# EAGLE design led_driver_1 (EAGLE 7.7.0)
DRAWING_NUMBER: V001; DRAWN: Mario Blunk / Blunk electronic; PROJECT: agile HW demo; STATUS: development

## Sheet 1 of 3: led driver
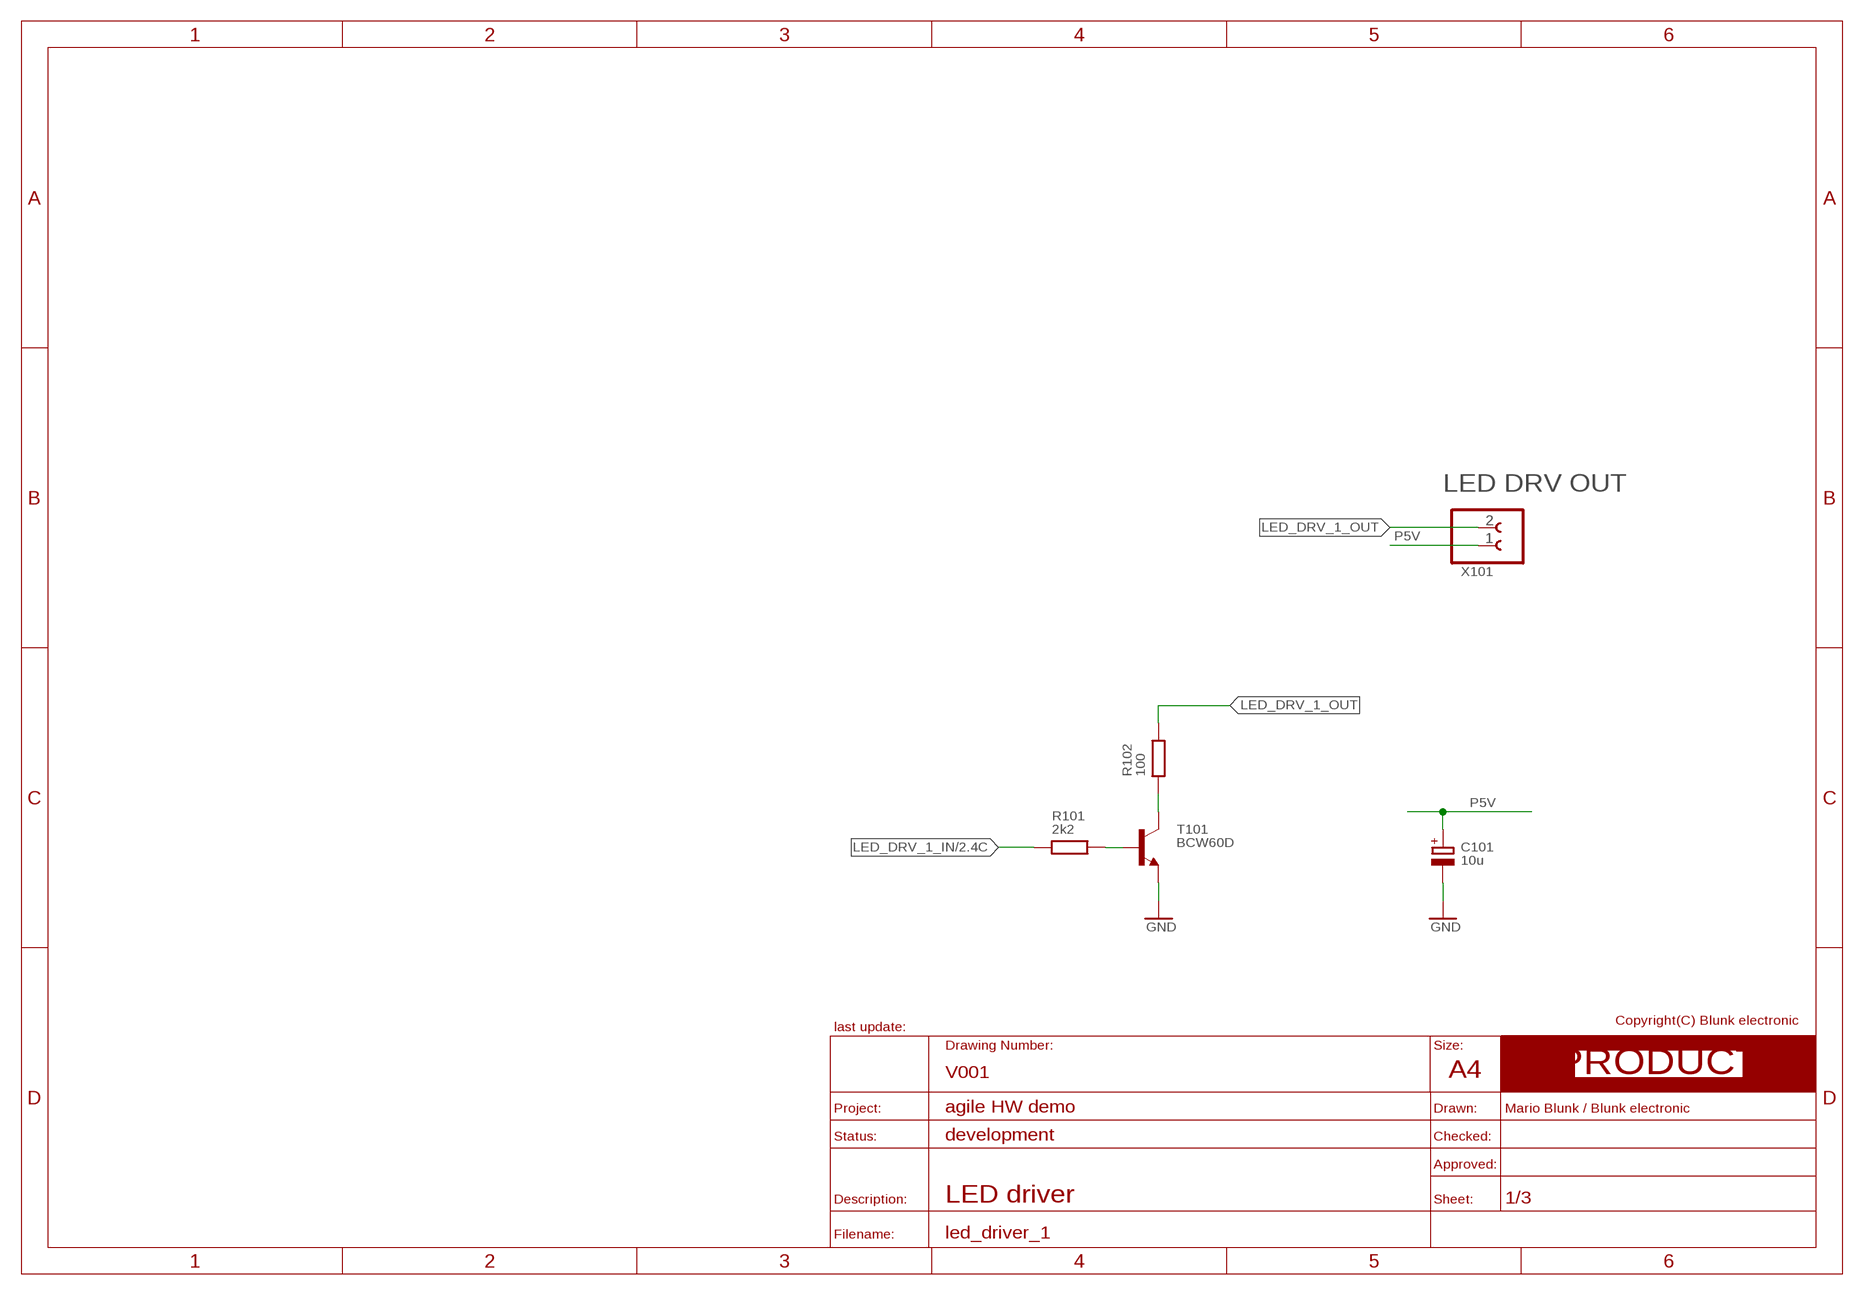
[diagram p0: schematic, sheet 1]
FRAME_PRODUCT1 (A4_LANDSCAPE_PRODUCT): BOM: NO; COMMISSIONED: 2013-08-30; DESCRIPTION: LED driver

### Parts
C101  10u  C_POL_S_6032  [S_6032]
R101  2k2  R_S_0805  [S_0805]
R102  100  R_S_0805  [S_0805]
T101  BCW60D  NPN_S_SOT23  [S_SOT23]
X101  CLAMP_1X2-T-2.5MM  [T_WIRE_CLAMP_1X2_PITCH_2MM5]

### Nets
GND: C101.- T101.2(E) ; also sheet 2,3
LED_DRV_1_B: R101.2 T101.1(B)
LED_DRV_1_C: R102.1 T101.3(C)
LED_DRV_1_IN: R101.1 ; also sheet 2
LED_DRV_1_OUT: R102.2 X101.2
P5V: C101.+ X101.1 ; also sheet 3

## Sheet 2 of 3: led module backend
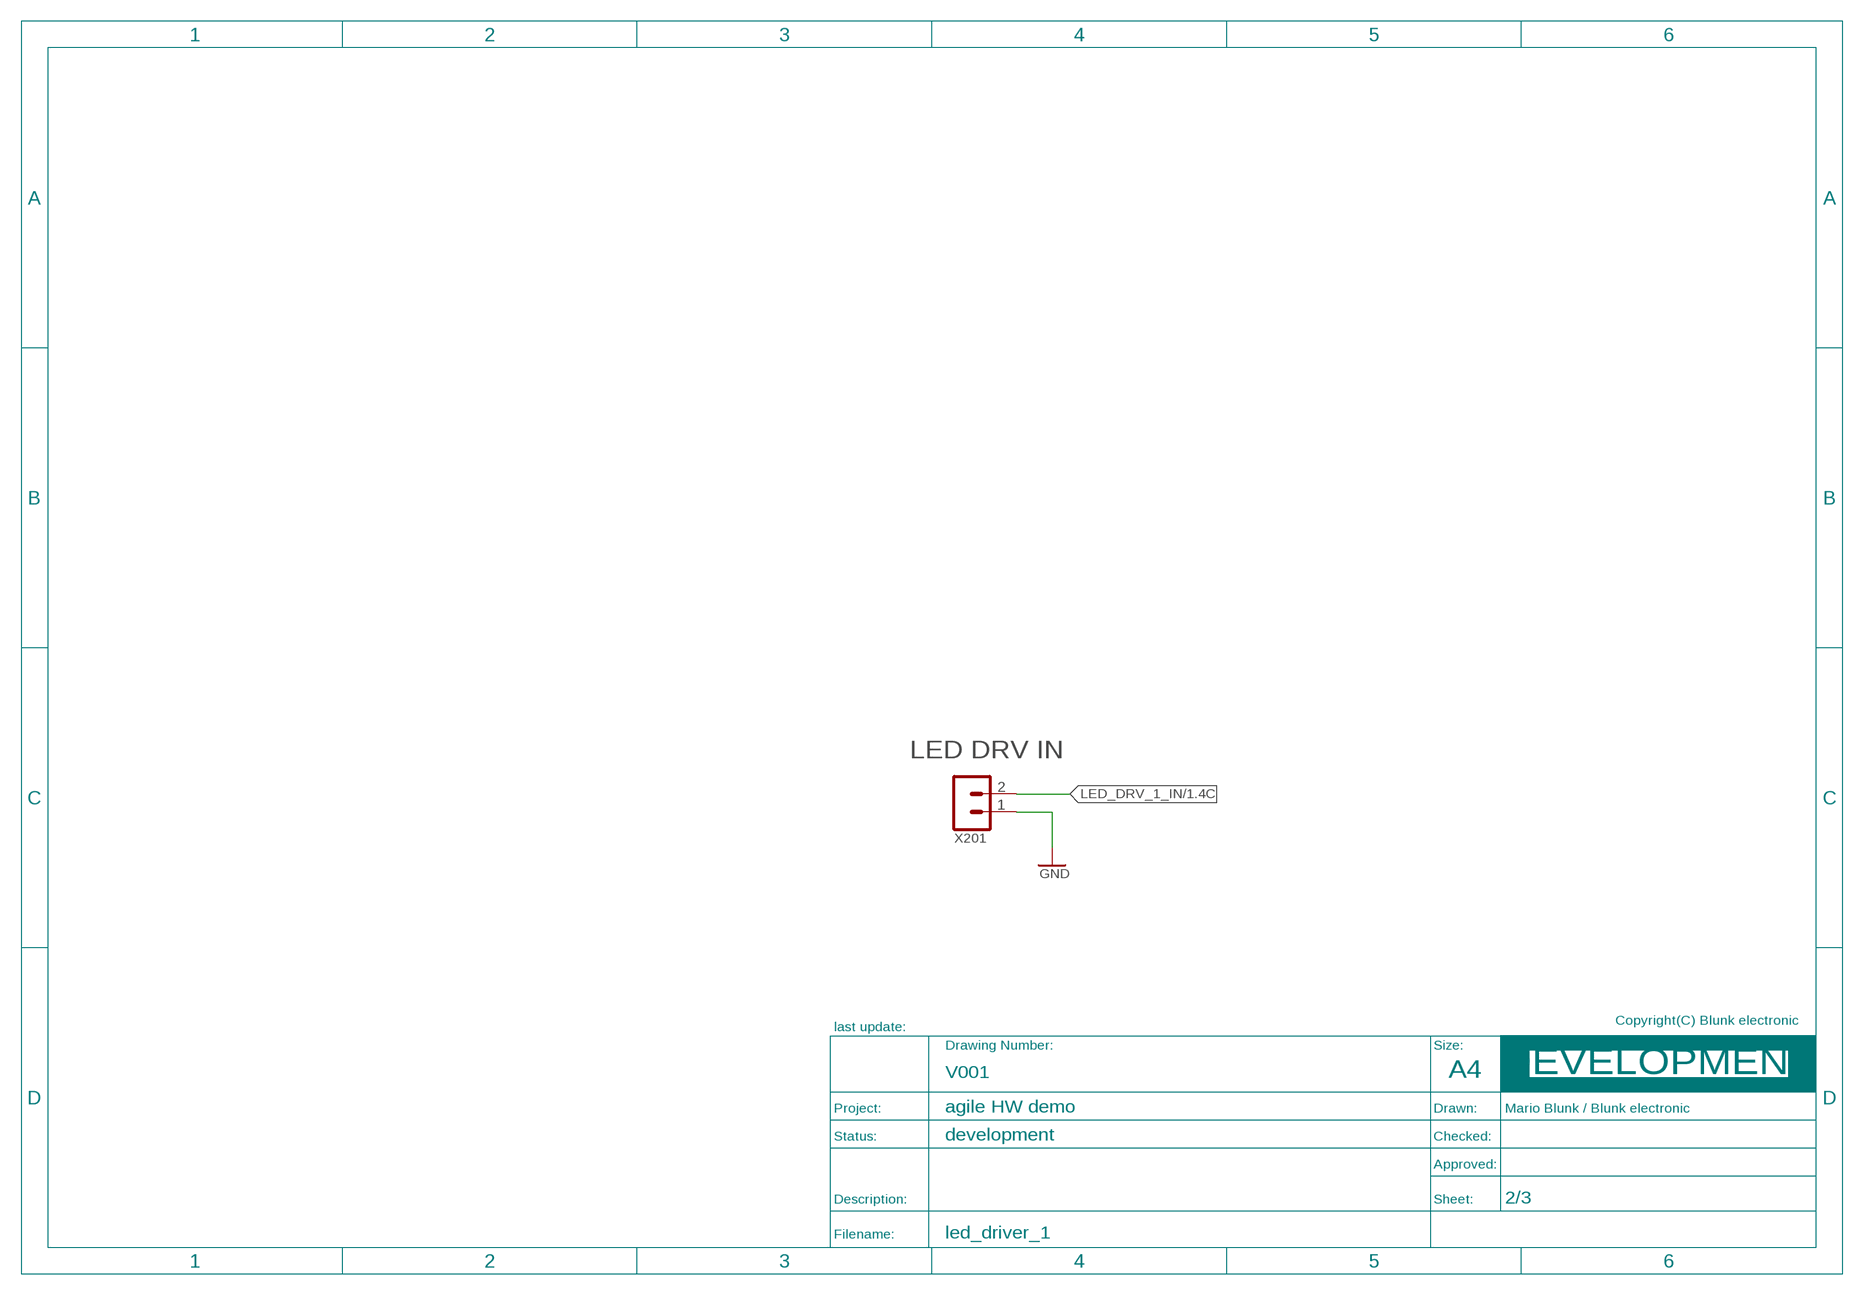
[diagram p1: schematic, sheet 2]
FRAME_DEVELOPMENT1 (A4_LANDSCAPE_DEVELOPMENT): BOM: NO; COMMISSIONED: 2013-08-30

### Parts
X201  MALE_2X1-T-VERTICAL  [T_MALE_2X1_VERTICAL_PITCH_2MM54]

### Nets
GND: X201.1 ; also sheet 1,3
LED_DRV_1_IN: X201.2 ; also sheet 1

## Sheet 3 of 3: led module pwr supply
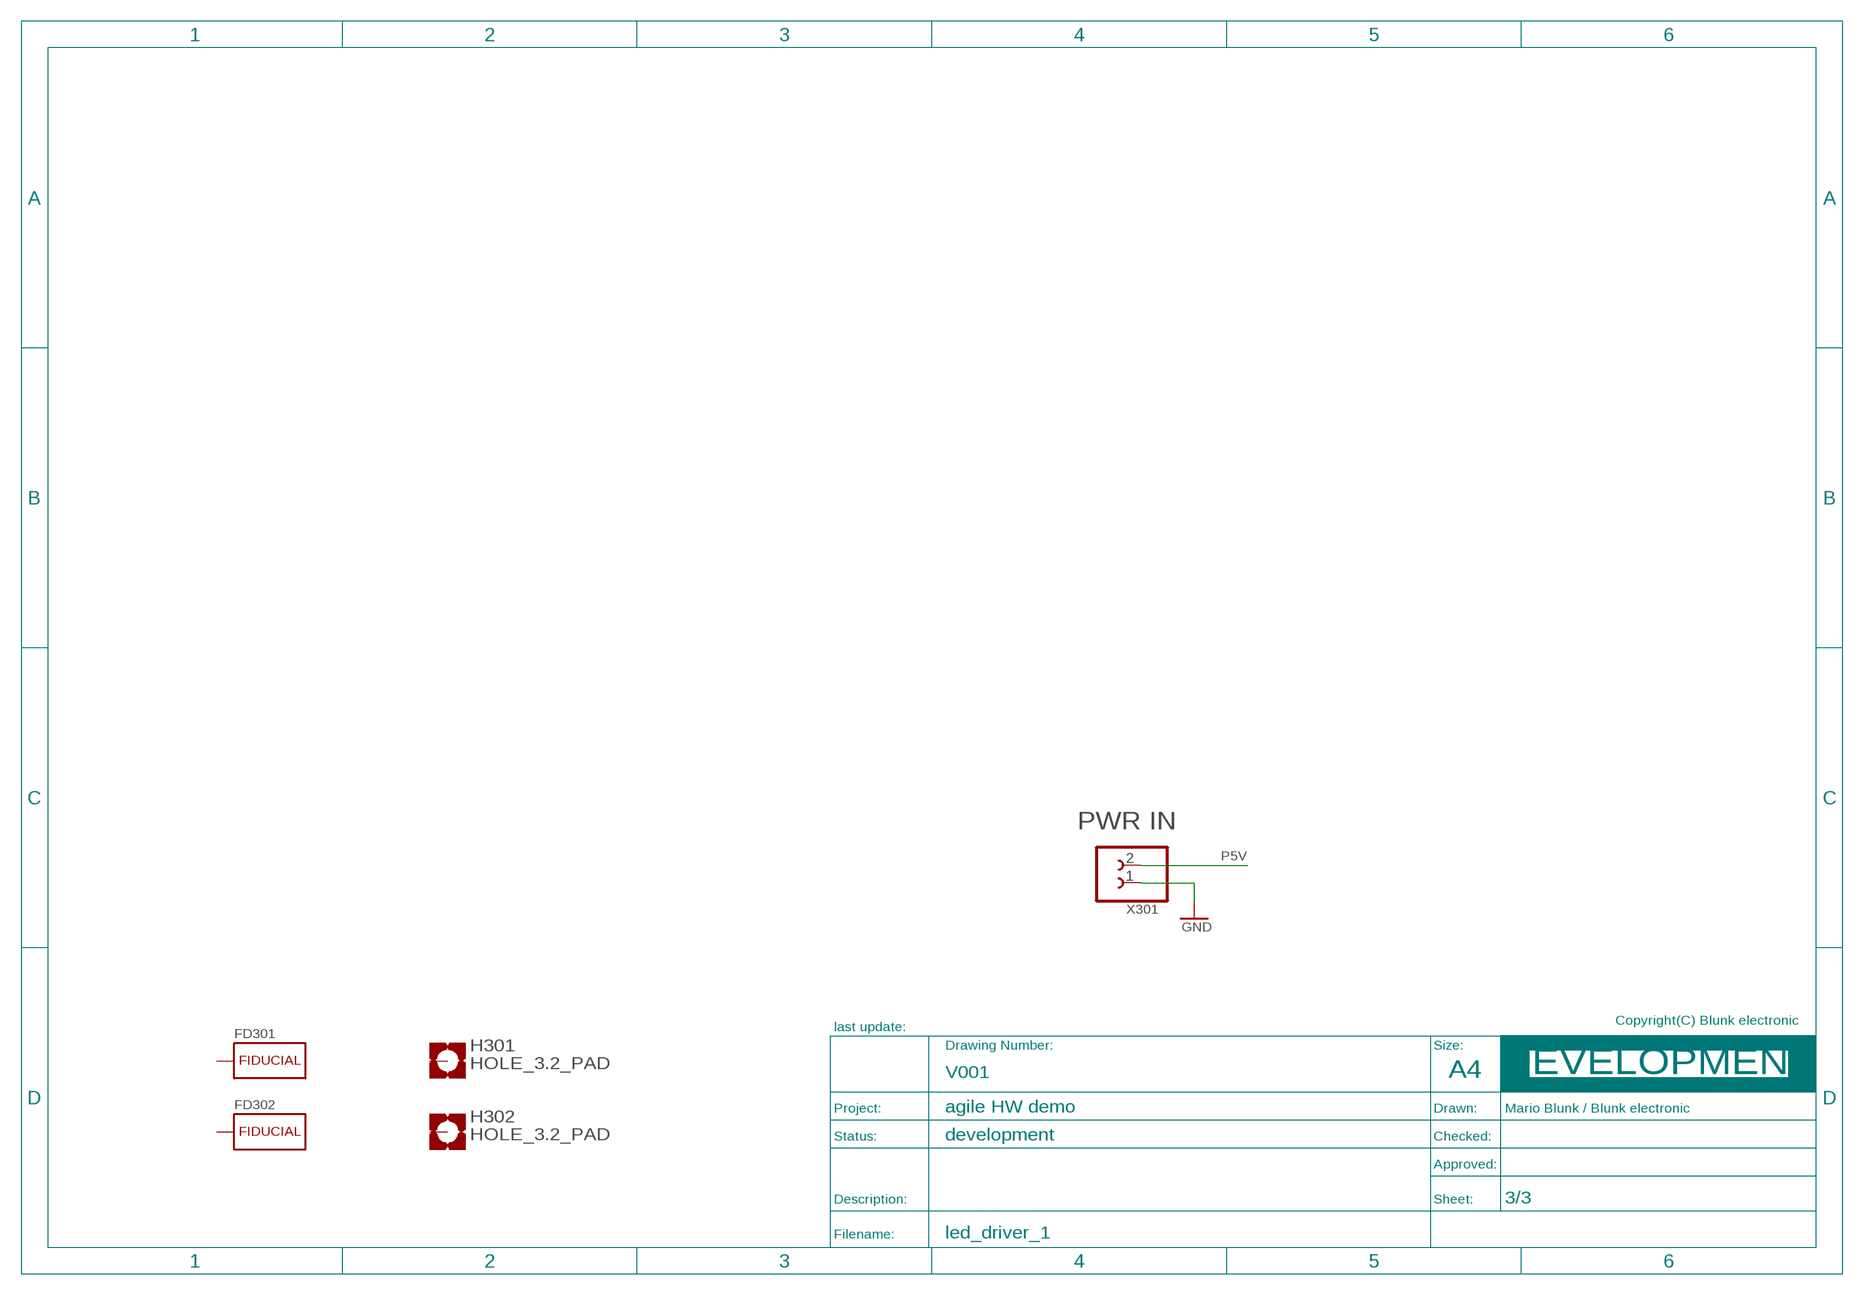
[diagram p2: schematic, sheet 3]
FRAME_DEVELOPMENT2 (A4_LANDSCAPE_DEVELOPMENT): BOM: NO; COMMISSIONED: 2013-08-30

### Parts
FD301  FIDUCIAL_CROSSHAIR  [CROSSHAIR]
FD302  FIDUCIAL_CROSSHAIR  [CROSSHAIR]
H301  HOLE_3.2_PAD  [3.2_PAD]
H302  HOLE_3.2_PAD  [3.2_PAD]
X301  CLAMP_1X2-T-2.5MM  [T_WIRE_CLAMP_1X2_PITCH_2MM5]

### Nets
GND: X301.1 ; also sheet 1,2
P5V: X301.2 ; also sheet 1
Unconnected: FD301.1(NC) FD302.1(NC) H301.H1(MOUNT) H302.H1(MOUNT)

## Library data of the parts
C101 = be_rcl:C_POL: edited: Mario Blunk / Blunk electronic; BOM: YES; COMMISSIONED: 2013-08-30; PART_CODE_BEL: C_PAC_S_6032_VAL_10u_Vmax_35V
FD301 FD302 = be_marks:FIDUCIAL: drawn: Mario Blunk / Blunk electronic; BOM: NO; COMMISSIONED: 2013-12-03
H301 H302 = be_holes:HOLE: edited: Mario Blunk; BOM: NO; COMMISSIONED: 2015-01-15
R101 = be_rcl:R: edited: Mario Blunk / Blunk electronic; BOM: YES; COMMISSIONED: 2013-08-30; PART_CODE_BEL: R_PAC_S_0805_VAL_2k2
R102 = be_rcl:R: edited: Mario Blunk / Blunk electronic; BOM: YES; COMMISSIONED: 2013-08-30; PART_CODE_BEL: R_PAC_S_0805_VAL_100
T101 = be_transistor:NPN: edited: Mario Blunk; BOM: YES; COMMISSIONED: 2013-08-30; PART_CODE_BEL: T_PAC_S_SOT23_VAL_BCW60D
X101 = be_con_jump:CLAMP_1X2: drawn: Mario Blunk / Blunk electronic; BOM: YES; COMMISSIONED: 2014-04-14; FUNCTION: LED DRV OUT; PART_CODE_BEL: X_PAC_T_CLAMP_1X2_PITCH_2mm5
X201 = be_con_jump:MALE_2X1: edited: Mario Blunk / Blunk electronic; BOM: YES; COMMISSIONED: 2013-08-30; FUNCTION: LED DRV IN; PART_CODE_BEL: X_PAC_T_MALE_2X1_VERTICAL_PITCH_2mm54; UPDATED: 2018-08-01
X301 = be_con_jump:CLAMP_1X2: drawn: Mario Blunk / Blunk electronic; BOM: YES; COMMISSIONED: 2014-04-14; FUNCTION: PWR IN; PART_CODE_BEL: X_PAC_T_CLAMP_1X2_PITCH_2mm5

## Board
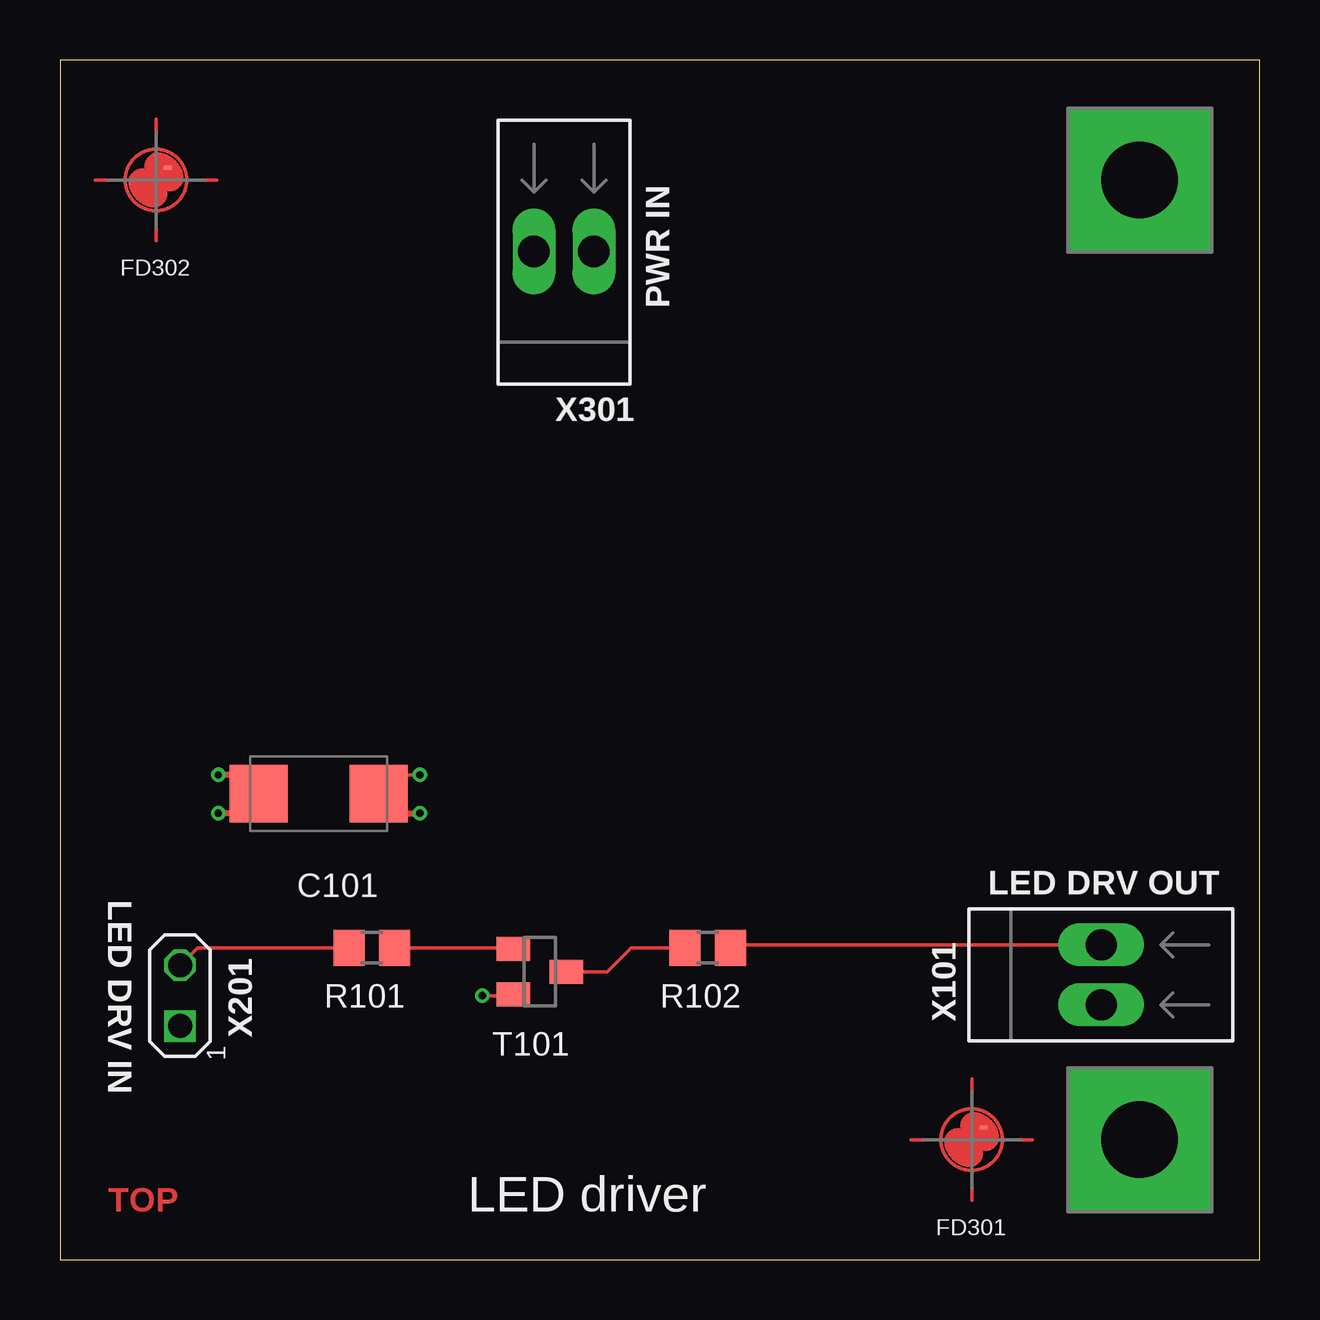
[diagram p3: board, top side]
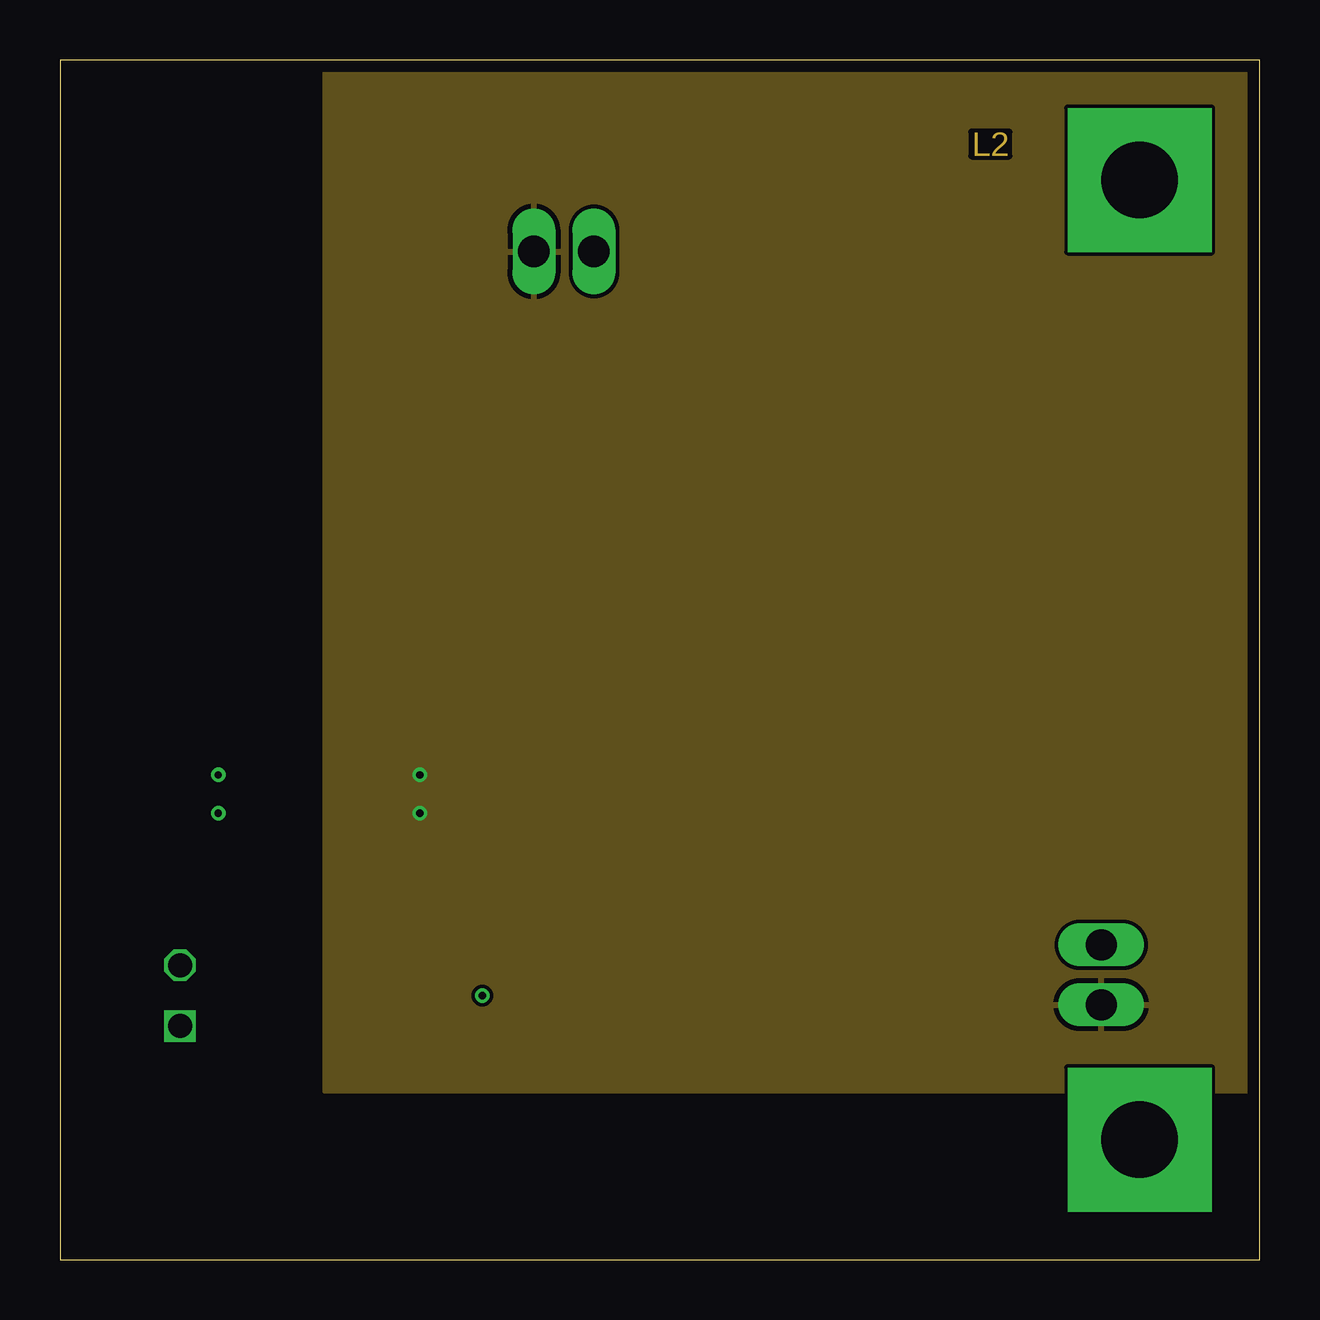
[diagram p4: board, inner layer Route2]
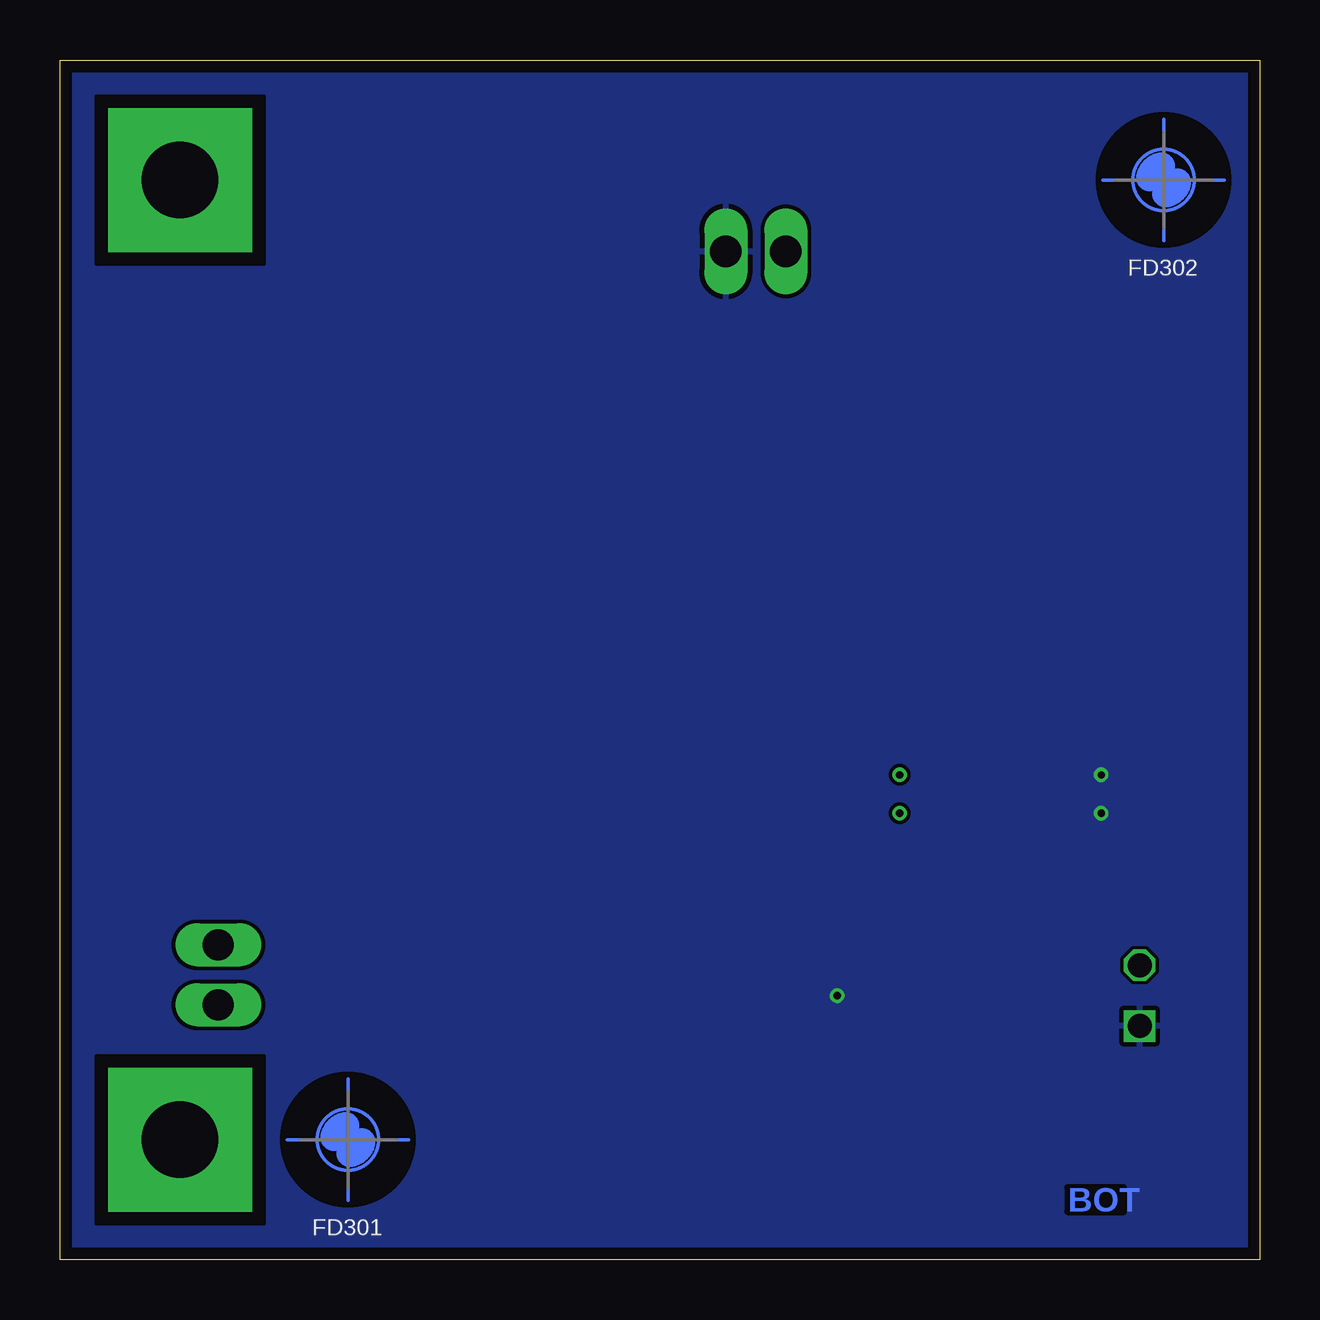
[diagram p5: board, bottom side, seen from below]

Size 50 x 50 mm. Coordinates in mm from the lower left corner, seen from the top.
Outline: 0,0 50,0 50,50 0,50 0,0
Copper layers (1+2*15+16): Top 0.018mm / dielectric 0.37mm / Route2 0.035mm / dielectric 0.65mm / Route15 0.035mm / dielectric 0.37mm / Bottom 0.018mm
Design rules "JLP_ML4_std": minimum track width 0.15mm, minimum drill 0.3mm, track to track 0.15mm, track to pad 0.15mm, pad to pad 0.15mm, via to via 0.15mm, smd to smd 0.15mm, copper to edge 0.5mm, drill to drill 0.2mm, minimum pad ring 0.15mm, minimum via ring 0.15mm, stop-mask expansion 0.075mm, vias tented up to drill 0.3mm, thermal gap 0.2mm

### Footprints (pad centres in the part's own frame; a part is rotated, then mirrored left to right if it is on the bottom)
S_6032 = smd 2.4 x 2.4: + -2.5,0; - 2.5,0
CROSSHAIR = smd 0.305 x 0.152: 1 0.5,0.5
3.2_PAD = drill 3.2 pad 6 square: H1 0,0
S_0805 = smd 1.3 x 1.5: 1 -0.95,0; 2 0.95,0
S_SOT23 = smd 1 x 1.4: 1 -0.95,-1.1; 2 0.95,-1.1; 3 0,1.1
T_WIRE_CLAMP_1X2_PITCH_2MM5 = drill 1.3 pad 1.8 long: 1 -1.25,-0.02; 2 1.25,-0.02
T_MALE_2X1_VERTICAL_PITCH_2MM54 = drill 1 square: 1 0,-1.27 | drill 1 octagon: 2 0,1.27

### Placement (x,y rotation side)
C101  10.78,19.41 180 top
FD301  38,5 0 top
FD302  4,45 0 top
H301  45,45 0 top
H302  45,5 0 top
R101  13,13 0 top
R102  27,13 0 top
T101  20,12 270 top
U$5  [A4_LANDSCAPE]  -165,-46 0 top  (outside the outline)
X101  43.38,11.87 90 top
X201  5,11 0 top
X301  21,42 180 top

### Tracks (layer width: path | path; a pad name or v marks a point on that pad's centre or on a via)
GND  (via drill 0.3)
  Top 0.15: T101.2 18.9,11 v17.6,11
  Top 0.254: v6.6,18.6 8.28,18.6 C101.- 8.28,20.2 v6.6,20.2
  pour Bottom: 0,50 50,50 50,0 0,0
LED_DRV_1_B
  Top 0.15: R101.2 18.85,13 T101.1
LED_DRV_1_C
  Top 0.15: T101.3 22.8,12 23.8,13 R102.1
LED_DRV_1_IN
  Top 0.15: X201.2 5.73,13 R101.1
LED_DRV_1_OUT
  Top 0.15: 43.28,13 X101.2 27.95,13.12 R102.2
P5V  (via drill 0.3)
  Top 0.15: 14,19 14,20.2 v15,20.2
  Top 0.254: 14,19 13.28,19 C101.+ 13.28,18.6 v15,18.6
  pour Route2: 11,50 50,50 50,7 11,7

### Text on the board
Top: TOP
Route2: L2
Bottom: BOT
tPlace: LED driver